# EAGLE design schedaSensori (EAGLE 8.4.0)
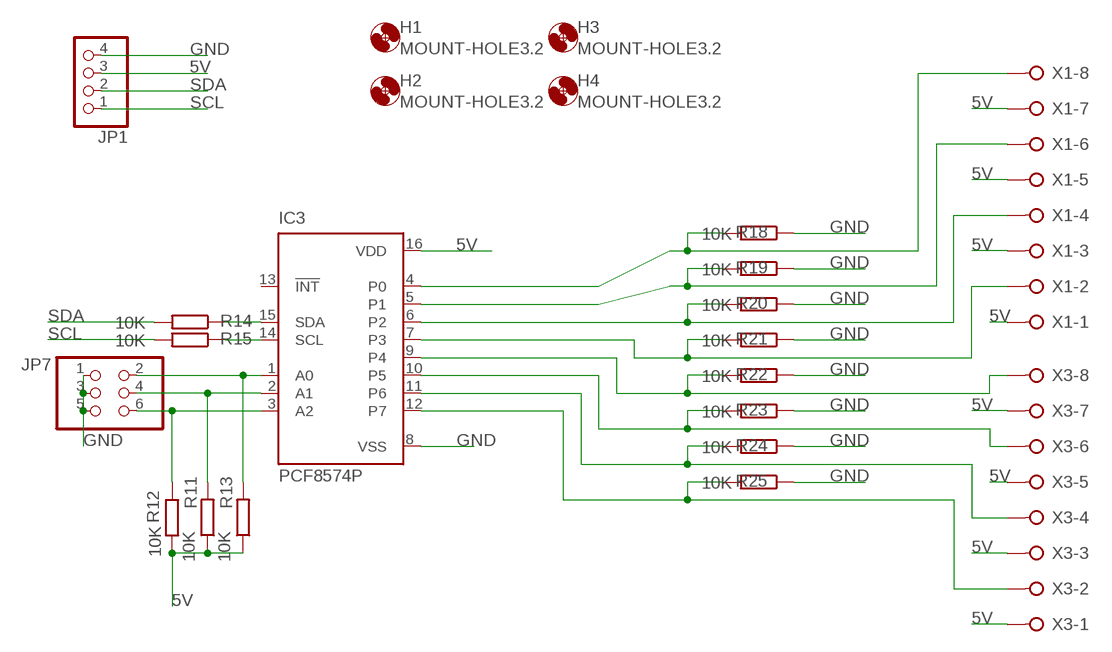
[diagram p0: schematic, sheet 1]

## Parts
H1  MOUNT-HOLE3.2  [3,2]
H2  MOUNT-HOLE3.2  [3,2]
H3  MOUNT-HOLE3.2  [3,2]
H4  MOUNT-HOLE3.2  [3,2]
IC3  PCF8574P  [DIL16]
JP1  PINHD-1X4  [1X04]
JP7  PINHD-2X3  [2X03]
R11  10K  R-EU_0207/10  [0207/10]
R12  10K  R-EU_0207/10  [0207/10]
R13  10K  R-EU_0207/10  [0207/10]
R14  10K  R-EU_0207/10  [0207/10]
R15  10K  R-EU_0207/10  [0207/10]
R18  10K  R-EU_0207/10  [0207/10]
R19  10K  R-EU_0207/10  [0207/10]
R20  10K  R-EU_0207/10  [0207/10]
R21  10K  R-EU_0207/10  [0207/10]
R22  10K  R-EU_0207/10  [0207/10]
R23  10K  R-EU_0207/10  [0207/10]
R24  10K  R-EU_0207/10  [0207/10]
R25  10K  R-EU_0207/10  [0207/10]
X1  W237-08P  [W237-8P]
X3  W237-08P  [W237-8P]

## Nets
5V: IC3.16(VDD) JP1.3 R11.1 R12.2 R13.1 X1.1 X1.3 X1.5 X1.7 X3.1 X3.3 X3.5 X3.7
GND: IC3.8(VSS) JP1.4 JP7.1 JP7.3 JP7.5 R18.1 R19.1 R20.1 R21.1 R22.1 R23.1 R24.1 R25.1
N$14: IC3.1(A0) JP7.2 R13.2
N$15: IC3.2(A1) JP7.4 R11.2
N$16: IC3.3(A2) JP7.6 R12.1
N$17: IC3.14(SCL) R15.1
N$18: IC3.15(SDA) R14.1
N$22: IC3.4(P0) R18.2 X1.8
N$23: IC3.5(P1) R19.2 X1.6
N$24: IC3.6(P2) R20.2 X1.4
N$25: IC3.7(P3) R21.2 X1.2
N$26: IC3.9(P4) R22.2 X3.8
N$27: IC3.10(P5) R23.2 X3.6
N$28: IC3.11(P6) R24.2 X3.4
N$29: IC3.12(P7) R25.2 X3.2
SCL: JP1.1 R15.2
SDA: JP1.2 R14.2
Unconnected: IC3.13(!INT)

## Library data of the parts
H1-H4 = holes:MOUNT-HOLE: MOUNTING HOLE with drill center marker
IC3 = micro-philips:PCF8574: I2C-Bus Remote 8-bit I/O expander http://www.semiconductors.philips.com/acrobat_download/datasheets/PCF8574_4.pdf; MPN: PCF8574PN; OC_FARNELL: 204020; OC_NEWARK: 11N8515
JP1 = pinhead:PINHD-1X4: PIN HEADER
JP7 = pinhead:PINHD-2X3: PIN HEADER
R11-R15 R18-R25 = rcl:R-EU_: RESISTOR, European symbol
X1 X3 = con-wago-508:W237-08P: WAGO SREW CLAMP; OC_FARNELL: unknown; OC_NEWARK: unknown

## Board
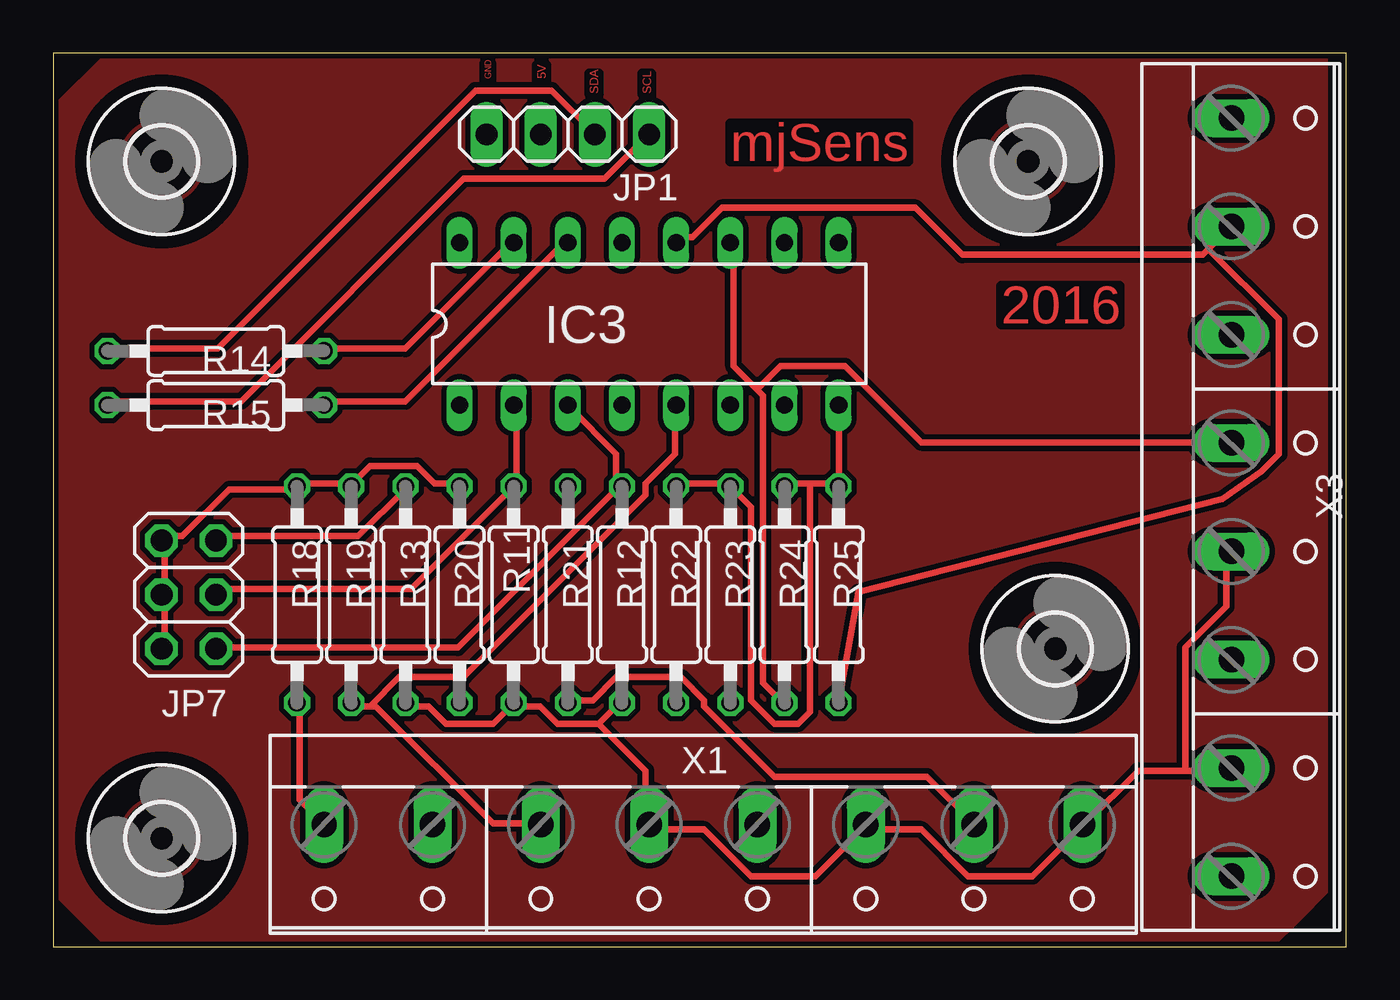
[diagram p1: board, top side]
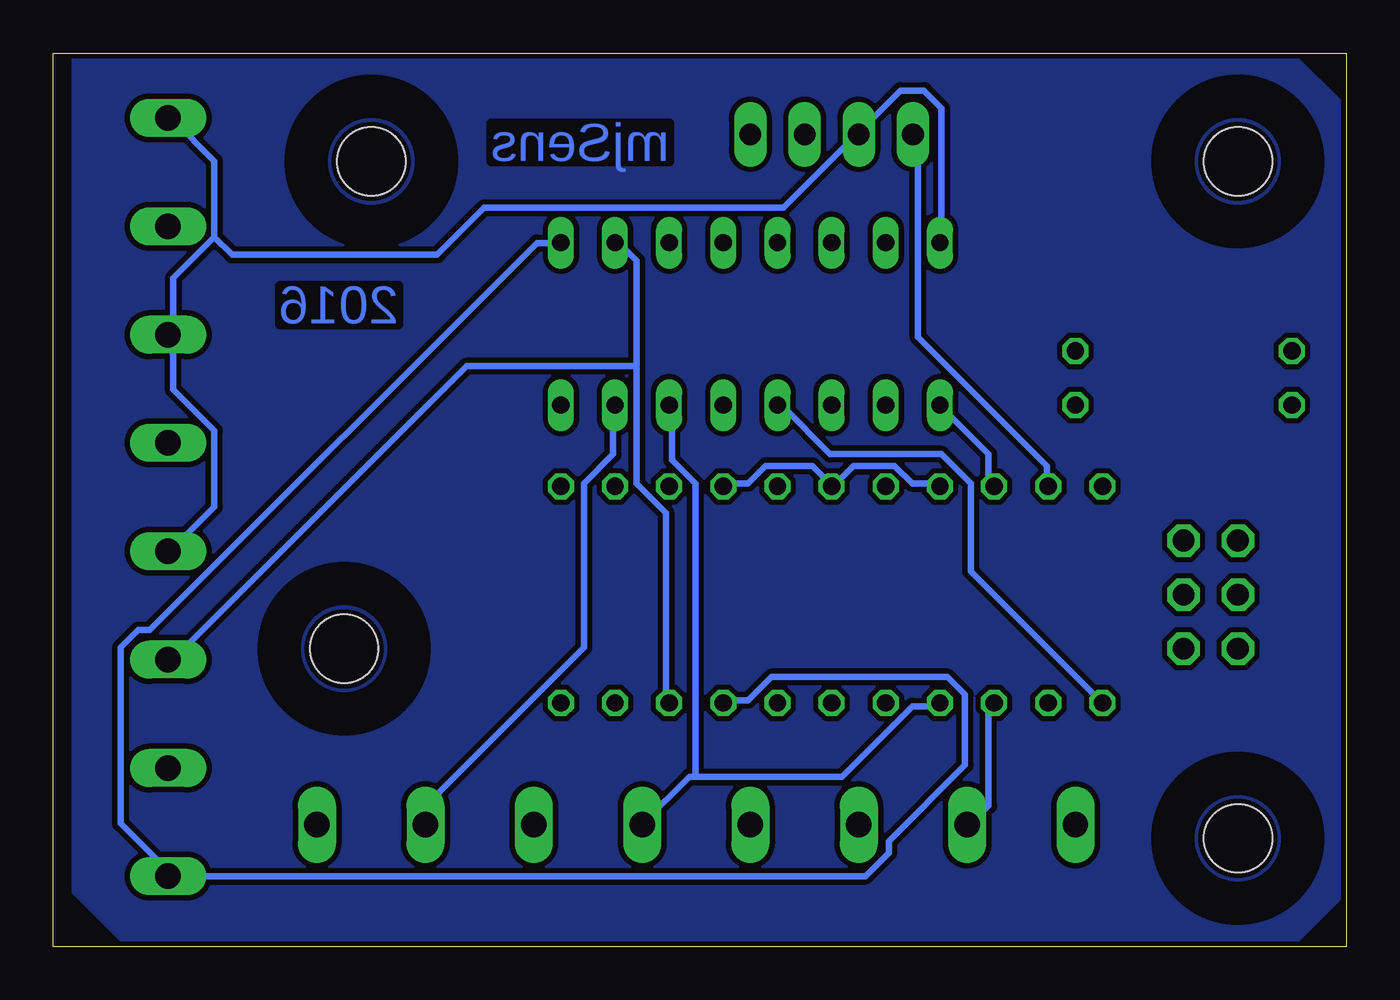
[diagram p2: board, bottom side, seen from below]

Size 60.63 x 41.9 mm. Coordinates in mm from the lower left corner, seen from the top.
Outline: 0,0 60.63,0 60.63,41.9 0,41.9 0,0
Copper layers (1*16): Top 0.018mm / dielectric 1.55mm / Bottom 0.018mm
Design rules "schedaSensori": minimum track width 0.3mm, minimum drill 0.35mm, track to track 0.25mm, track to pad 0.205mm, pad to pad 0.205mm, via to via 0.205mm, smd to smd 0mil, copper to edge 0.25mm, drill to drill 0.35mm, minimum pad ring 0.175mm, minimum via ring 0.125mm, stop-mask expansion 0mil, vias tented up to drill 0.45mm, thermal gap 0.2mm

### Footprints (pad centres in the part's own frame; a part is rotated, then mirrored left to right if it is on the bottom)
3,2 = hole 3.2: 0,0
DIL16 = drill 0.813 long: 1 -8.89,-3.81; 2 -6.35,-3.81; 3 -3.81,-3.81; 4 -1.27,-3.81; 5 1.27,-3.81; 6 3.81,-3.81; 7 6.35,-3.81; 8 8.89,-3.81; 9 8.89,3.81; 10 6.35,3.81; 11 3.81,3.81; 12 1.27,3.81; 13 -1.27,3.81; 14 -3.81,3.81; 15 -6.35,3.81; 16 -8.89,3.81
1X04 = drill 1.016 long: 1 -3.81,0; 2 -1.27,0; 3 1.27,0; 4 3.81,0
2X03 = drill 1.016 octagon: 1 -2.54,-1.27; 2 -2.54,1.27; 3 0,-1.27; 4 0,1.27; 5 2.54,-1.27; 6 2.54,1.27
0207/10 = drill 0.813 octagon: 1 -5.08,0; 2 5.08,0
W237-8P = drill 1.194 long: 1 -17.78,-0.635; 2 -12.7,-0.635; 3 -7.62,-0.635; 4 -2.54,-0.635; 5 2.54,-0.635; 6 7.62,-0.635; 7 12.7,-0.635; 8 17.78,-0.635

### Placement (x,y rotation side)
H1  5.08,36.83 0 top
H2  5.08,5.08 0 top
H3  45.72,36.83 0 top
H4  46.99,13.97 0 top
IC3  27.94,29.21 0 top
JP1  24.13,38.1 180 top
JP7  6.35,16.51 270 top
R11  21.59,16.51 90 top
R12  26.67,16.51 270 top
R13  16.51,16.51 90 top
R14  7.62,27.94 180 top
R15  7.62,25.4 180 top
R18  11.43,16.51 270 top
R19  13.97,16.51 270 top
R20  19.05,16.51 270 top
R21  24.13,16.51 270 top
R22  29.21,16.51 270 top
R23  31.75,16.51 270 top
R24  34.29,16.51 270 top
R25  36.83,16.51 270 top
X1  30.48,5.08 180 top
X3  55.88,21.08 270 top

### Tracks (layer width: path | path; a pad name or v marks a point on that pad's centre or on a via)
5V
  Top 0.3: 25.57,10.45 23.65,10.45 22.82,11.28 21.73,11.28 R11.1 21.45,11.28 20.62,10.45 18.43,10.45 17.6,11.28 16.77,11.28 R13.1 | 25.57,10.45 26.4,11.28 R12.2 | 25.57,10.45 27.77,8.25 27.77,5.78 X1.5 28.05,5.5 30.52,5.5 32.73,3.3 35.75,3.3 37.95,5.5 X1.3 38.23,5.5 40.7,5.5 42.9,3.3 45.92,3.3 48.12,5.5 X1.1 48.4,5.78 50.88,8.25 53.08,8.25 | 53.08,8.25 55,8.25 X3.7 | 53.08,8.25 53.08,14.03 55,15.95 55,18.43 X3.5
  Bottom 0.3: IC3.16 18.98,33.27 18.98,39.33 19.8,40.15 20.9,40.15 22.82,38.23 JP1.3 23.1,37.95 26.4,34.65 40.42,34.65 42.62,32.45 52.25,32.45 53.08,33.27 | 53.08,33.27 55,31.35 55,28.88 X3.3 55,28.6 55,26.12 53.08,24.2 53.08,20.62 55,18.7 X3.5 | 53.08,33.27 53.08,36.85 55,38.77 X3.1 | R13.1 16.77,11.28 16.77,6.6 17.6,5.78 X1.7
GND
  Top 0.3: 35.48,21.73 36.58,21.73 R25.1 36.85,21.73 36.85,25.3 IC3.8 | 35.48,21.73 34.38,21.73 R24.1 | R22.1 29.43,21.73 31.62,21.73 R23.1 31.9,21.45 32.73,20.62 32.73,11.55 33.83,10.45 34.92,10.45 35.48,11 35.48,21.73 | JP7.5 5.22,14.03 5.22,16.5 JP7.3 5.22,16.77 5.22,18.98 JP7.1 5.22,19.25 6.05,19.25 8.25,21.45 11.28,21.45 R18.1 11.55,21.73 13.75,21.73 R19.1 14.03,21.73 14.85,22.55 17.05,22.55 17.88,21.73 18.98,21.73 R20.1
  Bottom 0.3: R20.1 19.25,21.73 20.35,21.73 21.18,22.55 23.1,22.55 23.93,21.73 R21.1 24.2,21.73 25.02,22.55 27.23,22.55 28.05,21.73 29.15,21.73 R22.1 | JP1.4 20.07,37.95 20.07,28.6 14.03,22.55 14.03,21.73 R19.1
N$1
  pour Top: 0,39.37 2.54,41.91 59.69,41.91 59.69,2.54 58.42,1.27 57.15,0 2.54,0 0,2.54
N$2
  pour Bottom: 0,39.37 2.54,41.91 59.69,41.91 59.69,2.54 57.15,0 2.54,0 0,2.54
N$14
  Top 0.3: JP7.2 7.7,19.25 14.3,19.25 16.5,21.45 R13.2
  Bottom 0.3: R13.2 16.77,21.73 16.77,23.1 18.98,25.3 IC3.1
N$15
  Top 0.3: IC3.2 21.73,25.3 21.73,21.73 R11.2 16.77,16.77 7.7,16.77 JP7.4
N$16
  Top 0.3: IC3.3 24.2,25.3 26.4,23.1 26.4,21.73 R12.1 26.4,21.45 18.98,14.03 7.7,14.03 JP7.6
N$17
  Top 0.3: R15.1 12.93,25.57 16.5,25.57 23.93,33 IC3.14
N$18
  Top 0.3: R14.1 12.93,28.05 16.5,28.05 21.45,33 IC3.15
N$22
  Top 0.3: R18.2 11.55,11.28 11.55,6.88 12.65,5.78 X1.8
  Bottom 0.3: R18.2 17.6,17.6 17.6,21.73 18.98,23.1 24.2,23.1 26.4,25.3 IC3.4
N$23
  Top 0.3: 14.85,11.28 15.12,11.28 20.62,5.78 22.82,5.78 X1.6 | 14.85,11.28 14.03,11.28 R19.2 | 14.85,11.28 16.23,12.65 19.25,12.65 27.77,21.18 27.77,21.73 29.15,23.1 29.15,25.3 IC3.5
N$24
  Bottom 0.3: 30.52,7.97 30.8,7.97 33,5.78 X1.4 | 30.52,7.97 23.65,7.97 20.35,11.28 19.25,11.28 R20.2 | 30.52,7.97 30.52,21.73 31.62,22.82 31.62,25.3 IC3.6
N$25
  Top 0.3: R21.2 24.2,11.55 25.3,11.55 26.4,12.65 29.43,12.65 30.52,11.55 30.52,11.28 33.83,7.97 40.98,7.97 43.17,5.78 X1.2
  Bottom 0.3: IC3.7 34.38,25.3 34.38,23.1 35.75,21.73 35.75,14.03 43.17,6.6 43.17,5.78 X1.2
N$26
  Bottom 0.3: R22.2 29.15,11.55 28.05,11.55 26.95,12.65 18.7,12.65 17.88,11.82 17.88,8.53 21.45,4.95 21.45,4.4 22.55,3.3 55,3.3 X3.8 55.27,3.58 57.48,5.78 57.48,14.03 56.65,14.85 56.1,14.85 37.95,33 36.85,33 IC3.9
N$27
  Bottom 0.3: 33.27,27.23 33.27,32.17 34.1,33 IC3.10 | 33.27,27.23 33.27,21.73 31.9,20.35 31.9,11.55 R23.2 | 33.27,27.23 41.25,27.23 55,13.47 X3.6
N$28
  Top 0.3: 33,26.12 33.27,25.85 33.27,12.38 34.1,11.55 R24.2 | 33,26.12 31.9,27.23 31.9,33 IC3.11 | 33,26.12 34.1,27.23 37.12,27.23 40.7,23.65 55,23.65 X3.4
N$29
  Top 0.3: 54.17,32.73 55,33.55 X3.2 | 54.17,32.73 53.9,32.45 42.62,32.45 40.42,34.65 31.35,34.65 29.98,33.27 29.43,33.27 IC3.12 | 54.17,32.73 57.48,29.43 57.48,23.1 56.65,22.27 54.83,21 37.76,16.63 36.85,11.55 R25.2
SCL
  Top 0.3: R15.2 2.75,25.57 8.8,25.57 19.25,36.02 25.85,36.02 27.77,37.95 JP1.1
SDA
  Top 0.3: R14.2 2.75,28.05 7.7,28.05 19.8,40.15 23.38,40.15 25.3,38.23 JP1.2

### Text on the board
Top: GND | 5V | SDA | SCL | mjSens | 2016
Bottom: mjSens | 2016